# EAGLE schematic Lab 1 (EAGLE 9.5.2)
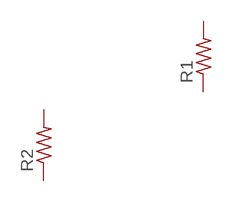
[diagram p0: schematic, sheet 1]

## Parts
R1  R-US_M0805  [M0805]
R2  R-US_M0805  [M0805]
Unconnected: R1.1 R1.2 R2.1 R2.2

## Library data of the parts
R1 R2 = rcl:R-US_: RESISTOR, American symbol; SPICEPREFIX: R